# EAGLE design UTX_EE445M_Motor_Board (EAGLE 9.2.2)
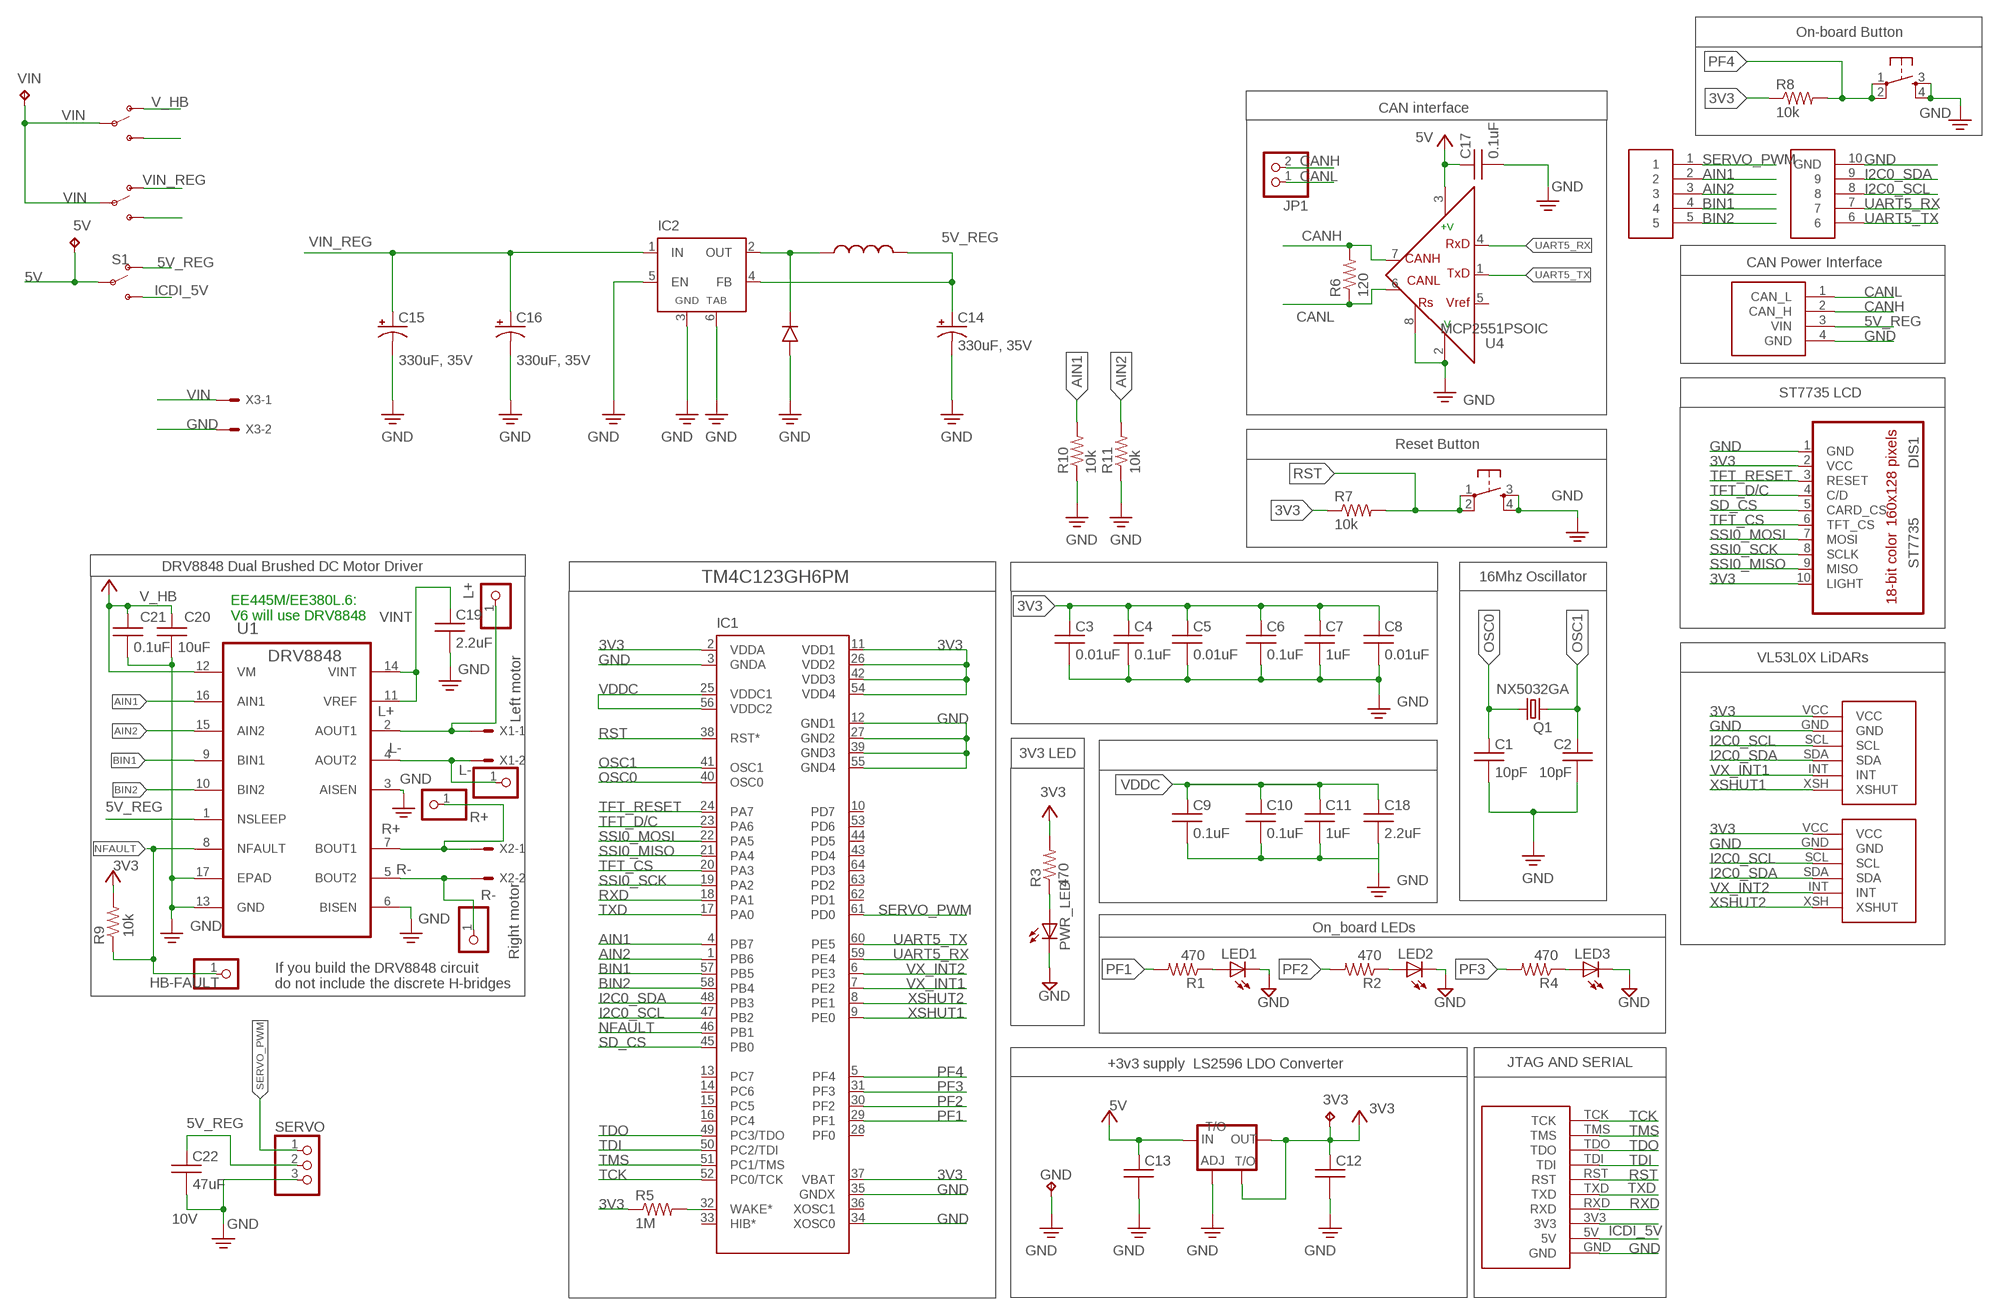
[diagram p0: schematic, sheet 1]

## Parts
3V3  TPPAD1-13  [P1-13]
5V  TPPAD1-13  [P1-13]
BUTTON  _SWITCH_DTSM-6  [_SWITCH_DTSM-6]
C1  10pF  CAPACITORC0603K  [C0603K]
C2  10pF  CAPACITORC0603K  [C0603K]
C3  0.01uF  CAPACITORC0603K  [C0603K]
C4  0.1uF  CAPACITORC0603K  [C0603K]
C5  0.01uF  CAPACITORC0603K  [C0603K]
C6  0.1uF  CAPACITORC0603K  [C0603K]
C7  1uF  CAPACITORC0603K  [C0603K]
C8  0.01uF  CAPACITORC0603K  [C0603K]
C9  0.1uF  CAPACITORC0603K  [C0603K]
C10  0.1uF  CAPACITORC0603K  [C0603K]
C11  1uF  CAPACITORC0603K  [C0603K]
C12  CAPACITORC0805K  [C0805K]
C13  CAPACITORC0603K  [C0603K]
C14  330uF, 35V  _CAPACITOR_POL_A_HA0  [_CAPACITOR_CHEMI-CON_A_HA0_SMD]
C15  330uF, 35V  _CAPACITOR_POL_A_HA0  [_CAPACITOR_CHEMI-CON_A_HA0_SMD]
C16  330uF, 35V  _CAPACITOR_POL_A_HA0  [_CAPACITOR_CHEMI-CON_A_HA0_SMD]
C17  0.1uF  CAPACITORC0603K  [C0603K]
C18  2.2uF  CAPACITORC0603K  [C0603K]
C19  2.2uF  CAPACITORC0603K  [C0603K]
C20  10uF  CAPACITORC0805K  [C0805K]
C21  0.1uF  CAPACITORC0603K  [C0603K]
C22  47uF  CAPACITORC0805K  [C0805K]
DIS1  ST7735  [ST7735]
GND  TPPAD1-13  [P1-13]
HB-FAULT  PINHD-1X1  [1X01]
IC1  TM4C123GH6PM  [SQFP-S-10X10-64]
IC2  _VOLTAG_REGULATOR_LM2596S  [_PACKAGE_TO263-5]
JP1  PINHD-1X2  [1X02]
L+  PINHD-1X1  [1X01]
L-  PINHD-1X1  [1X01]
LED1  LEDCHIP-LED0603  [CHIP-LED0603]
LED2  LEDCHIP-LED0603  [CHIP-LED0603]
LED3  LEDCHIP-LED0603  [CHIP-LED0603]
PWR_LED  LEDCHIP-LED0603  [CHIP-LED0603]
Q1  NX5032GA  [NX5032GA]
R1  470  RESISTORR0603  [R0603]
R2  470  RESISTORR0603  [R0603]
R3  470  R-US_R0603  [R0603]
R4  470  RESISTORR0603  [R0603]
R5  1M  RESISTORR0603  [R0603]
R6  120  RESISTORR0603  [R0603]
R7  10k  RESISTORR0603  [R0603]
R8  10k  RESISTORR0603  [R0603]
R9  10k  RESISTORR0603  [R0603]
R10  10k  RESISTORR0603  [R0603]
R11  10k  RESISTORR0603  [R0603]
R+  PINHD-1X1  [1X01]
R-  PINHD-1X1  [1X01]
RESET  _SWITCH_DTSM-6  [_SWITCH_DTSM-6]
S1  SWITCH-SPDT-PTH-11.6X4.0MM  [SWITCH_SPDT_PTH_11.6X4.0MM]
SERVO  PINHD-1X3  [1X03]
U1  DRV8848  [SOP65P640X120-17N]
U4  MCP2551PSOIC  [SO08]
U$1  JTAG_SERIAL  [JTAG_SERIAL_PTH]
U$2  LIDAR_VL53L0X_ATK_VERT  [LIDAR_VL53L0X_ATK_VERT]
U$3  LIDAR_VL53L0X_ATK_VERT  [LIDAR_VL53L0X_ATK_VERT]
U$4  _SWITCH_SPDT_4.7  [_SWITCH_SPDT_4.7]
U$5  _SWITCH_SPDT_4.7  [_SWITCH_SPDT_4.7]
U$9  _VOLTAGE_REGULATOR_AMS1117  [_PACKAGE_SOT223]
U$10  UTX_EE445M_BOARD_CONNECTOR  [_HEADER_2_4X1_ANGLED]
U$11  LOGIC_ANALYZER_10PIN  [LOGIC_ANALYZER_10PIN]
U$23  _INDUCTOR_PE-54040SNL  [_PACKAGE_HCI-68]
U$24  _DIODE_SOD128  [_PACKAGE_SOD128]
VIN  TPPAD1-13  [P1-13]
X1  KK-156-2  [KK-156-2]
X2  KK-156-2  [KK-156-2]
X3  KK-156-2  [KK-156-2]

## Nets
3V3: 3V3.TP C3.1 C4.1 C5.1 C6.1 C7.1 C8.1 C12.1 DIS1.2(VCC) DIS1.10(LIGHT) IC1.2(VDDA) IC1.11(VDD1) IC1.26(VDD2) IC1.37(VBAT) IC1.42(VDD3) IC1.54(VDD4) R3.2 R5.1 R7.1 R8.1 R9.2 U$2.VCC U$3.VCC U$9.2(OUT) U$9.4(T/O) ; supply symbol labelled +5V, +3V3
5V: 5V.TP C13.1 C17.1 S1.2(P) U4.3(VDD) U$9.3(IN) ; supply symbol labelled +5V
5V_REG: C14.+ C22.1 IC2.4(FB) S1.1(O) SERVO.2 U1.1(NSLEEP) U$10.3(VIN) U$23.2
AIN1: IC1.4(PB7) R10.2 U1.16(AIN1) U$11.2
AIN2: IC1.1(PB6) R11.2 U1.15(AIN2) U$11.3
BIN1: IC1.57(PB5) U1.9(BIN1) U$11.4
BIN2: IC1.58(PB4) U1.10(BIN2) U$11.5
CANH: JP1.2 R6.2 U4.7(CANH) U$10.2(CAN_H)
CANL: JP1.1 R6.1 U4.6(CANL) U$10.1(CAN_L)
GND: BUTTON.3 BUTTON.4 C1.2 C2.2 C3.2 C4.2 C5.2 C6.2 C7.2 C8.2 C9.2 C10.2 C11.2 C12.2 C13.2 C14.- C15.- C16.- C17.2 C18.2 C19.2 C20.2 C21.2 C22.2 DIS1.1(GND) GND.TP IC1.3(GNDA) IC1.12(GND1) IC1.27(GND2) IC1.34(XOSC0) IC1.35(GNDX) IC1.39(GND3) IC1.55(GND4) IC2.3(GND) IC2.5(EN) IC2.6(TAB) LED1.C LED2.C LED3.C PWR_LED.C R10.1 R11.1 RESET.3 RESET.4 SERVO.3 U1.3(AISEN) U1.6(BISEN) U1.13(GND) U1.17(EPAD) U4.2(VSS) U4.8(RS) U$1.GND U$2.GND U$3.GND U$9.1(ADJ) U$10.4(GND) U$11.10(GND) U$24.A(+) X3.2
I2C0_SCL: IC1.47(PB2) U$2.SCL U$3.SCL U$11.8
I2C0_SDA: IC1.48(PB3) U$2.SDA U$3.SDA U$11.9
ICDI_5V: S1.3(S) U$1.5V
L+: L+.1 U1.2(AOUT1) X1.1
L-: L-.1 U1.4(AOUT2) X1.2
N$1: U$1.3V3
N$4: LED1.A R1.1
N$6: PWR_LED.A R3.1
N$7: LED2.A R2.1
N$8: LED3.A R4.1
N$9: U$4.P$3(S)
N$11: IC2.2(OUT) U$23.1 U$24.C(-)
N$12: U$5.P$3(S)
N$19: IC1.32(WAKE*) R5.2
NFAULT: HB-FAULT.1 IC1.46(PB1) R9.1 U1.8(NFAULT)
OSC0: C1.1 IC1.40(OSC0) Q1.1
OSC1: C2.1 IC1.41(OSC1) Q1.2
PF1: IC1.29(PF1) R1.2
PF2: IC1.30(PF2) R2.2
PF3: IC1.31(PF3) R4.2
PF4: BUTTON.1 BUTTON.2 IC1.5(PF4) R8.2
R+: R+.1 U1.7(BOUT1) X2.1
R-: R-.1 U1.5(BOUT2) X2.2
RST: IC1.38(RST*) R7.2 RESET.1 RESET.2 U$1.RST
RXD: IC1.18(PA1) U$1.RXD
SD_CS: DIS1.5(CARD_CS) IC1.45(PB0)
SERVO_PWM: IC1.61(PD0) SERVO.1 U$11.1
SSI0_MISO: DIS1.9(MISO) IC1.21(PA4)
SSI0_MOSI: DIS1.7(MOSI) IC1.22(PA5)
SSI0_SCK: DIS1.8(SCLK) IC1.19(PA2)
TCK: IC1.52(PC0/TCK) U$1.TCK
TDI: IC1.50(PC2/TDI) U$1.TDI
TDO: IC1.49(PC3/TDO) U$1.TDO
TFT_CS: DIS1.6(TFT_CS) IC1.20(PA3)
TFT_D/C: DIS1.4(C/D) IC1.23(PA6)
TFT_RESET: DIS1.3(RESET) IC1.24(PA7)
TMS: IC1.51(PC1/TMS) U$1.TMS
TXD: IC1.17(PA0) U$1.TXD
UART5_RX: IC1.59(PE4) U4.4(RXD) U$11.7
UART5_TX: IC1.60(PE5) U4.1(TXD) U$11.6
V_HB: C20.1 C21.1 U1.12(VM) U$4.P$1(O) ; supply symbol labelled +11V1
VDDC: C9.1 C10.1 C11.1 C18.1 IC1.25(VDDC1) IC1.56(VDDC2)
VIN: U$4.P$2(P) U$5.P$2(P) VIN.TP X3.1
VIN_REG: C15.+ C16.+ IC2.1(IN) U$5.P$1(O)
VINT: C19.1 U1.11(VREF) U1.14(VINT)
VX_INT1: IC1.7(PE2) U$2.INT
VX_INT2: IC1.6(PE3) U$3.INT
XSHUT1: IC1.9(PE0) U$2.XSH(XSHUT)
XSHUT2: IC1.8(PE1) U$3.XSH(XSHUT)
Unconnected: IC1.10(PD7) IC1.13(PC7) IC1.14(PC6) IC1.15(PC5) IC1.16(PC4) IC1.28(PF0) IC1.33(HIB*) IC1.36(XOSC1) IC1.43(PD4) IC1.44(PD5) IC1.53(PD6) IC1.62(PD1) IC1.63(PD2) IC1.64(PD3) U4.5(VREF)

## Notes on the sheet
- On-board Button
- CAN interface
- CAN Power Interface
- ST7735 LCD
- Reset Button
- DRV8848 Dual Brushed DC Motor Driver
- 16Mhz Oscillator
- EE445M/EE380L.6: 
  V6 will use DRV8848
- VL53L0X LiDARs
- Left motor
- 3V3 LED
- On_board LEDs
- Right motor
- If you build the DRV8848 circuit
  do not include the discrete H-bridges
- +3v3 supply  LS2596 LDO Converter | JTAG AND SERIAL
- 10V

## Library data of the parts
3V3 5V GND VIN = testpad:TP: Test pad
BUTTON RESET = Z:_SWITCH_DTSM-6
C1 C3-C13 C17-C19 C21 C22 = UT_ECE:CAPACITOR: CAPACITOR, American symbol
C2 = UT_ECE:CAPACITOR: CAPACITOR, American symbol; SPICEPREFIX: C
C14-C16 = Z:_CAPACITOR_POL
C20 = EE445L:CAPACITOR: CAPACITOR, American symbol
DIS1 = UT_ECE:ST7735: Sitronix ST7735R 18-bit color, 1.8" TFT LCD display, 128*160, http://www.adafruit.com/products/358 // Backlight (pin 10) connected to +3.3 V // MISO (pin 9) PA4 (SSI0Rx) // SCK (pin 8) connected to PA2 (SSI0Clk) // MOSI (pin 7) connected to PA5 (SSI0Tx) // TFT_CS (pin 6) connected to PA3 (SSI0Fss) // CARD_CS (pin 5) connected to PD7 GPIO output(for SDC) // Data/Command (pin 4) connected to PA6 (GPIO), high for data, low for command // RESET (pin 3) connected to PA7 (GPIO) // VCC (pin 2) connected to +3.3 V // Gnd (pin 1) connected to ground; OC_FARNELL: unknown; OC_NEWARK: unknown
HB-FAULT L+ L- R+ R- = EE445L:PINHD-1X1: PIN HEADER
IC1 = UT_ECE:TM4C123: Tiva™ TM4C123GH6PM Microcontroller Texas Instrument's Tiva™ C Series microcontrollers provide designers a high-performance ARM® Cortex™-M-based architecture with a broad set of integration capabilities and a strong ecosystem of software and development tools. Targeting performance and flexibility, the Tiva™ C Series architecture offers a 80 MHz Cortex-M with FPU, a variety of integrated memories and multiple programmable GPIO. Tiva™ C Series devices offer consumers compelling cost-effective solutions by integrating application-specific peripherals and providing a comprehensive library of software tools which minimize board costs and design-cycle time. Offering quicker time-to-market and cost savings, the Tiva™ C Series microcontrollers are the leading choice in high-performance 32-bit applications.
IC2 = Z:_VOLTAG_REGULATOR: STEP-DOWN VOLTAGE REGULATOR
JP1 = UT_ECE:PINHD-1X2: PIN HEADER
LED1-LED3 PWR_LED = led:LED: LED OSRAM: - CHIPLED LG R971, LG N971, LY N971, LG Q971, LY Q971, LO R971, LY R971 LH N974, LH R974 LS Q976, LO Q976, LY Q976 LO Q996 - Hyper CHIPLED LW Q18S LB Q993, LB Q99A, LB R99A - SideLED LS A670, LO A670, LY A670, LG A670, LP A670 LB A673, LV A673, LT A673, LW A673 LH A674 LY A675 LS A676, LA A676, LO A676, LY A676, LW A676 LS A679, LY A679, LG A679 - Hyper Micro SIDELED® LS Y876, LA Y876, LO Y876, LY Y876 LT Y87S - SmartLED LW L88C, LW L88S LB L89C, LB L89S, LG L890 LS L89K, LO L89K, LY L89K LS L896, LA L896, LO L896, LY L896 - TOPLED LS T670, LO T670, LY T670, LG T670, LP T670 LSG T670, LSP T670, LSY T670, LOP T670, LYG T670 LG T671, LOG T671, LSG T671 LB T673, LV T673, LT T673, LW T673 LH T674 LS T676, LA T676, LO T676, LY T676, LB T676, LH T676, LSB T676, LW T676 LB T67C, LV T67C, LT T67C, LS T67K, LO T67K, LY T67K, LW E67C LS E67B, LA E67B, LO E67B, LY E67B, LB E67C, LV E67C, LT E67C LW T67C LS T679, LY T679, LG T679 LS T770, LO T770, LY T770, LG T770, LP T770 LB T773, LV T773, LT T773, LW T773 LH T774 LS E675, LA E675, LY E675, LS T675 LS T776, LA T776, LO T776, LY T776, LB T776 LHGB T686 LT T68C, LB T68C - Hyper Mini TOPLED® LB M676 - Mini TOPLED Santana® LG M470 LS M47K, LO M47K, LY M47K Source: http://www.osram.convergy.de LUXEON: - LUMILED® LXK2-PW12-R00, LXK2-PW12-S00, LXK2-PW14-U00, LXK2-PW14-V00 LXK2-PM12-R00, LXK2-PM12-S00, LXK2-PM14-U00 LXK2-PE12-Q00, LXK2-PE12-R00, LXK2-PE12-S00, LXK2-PE14-T00, LXK2-PE14-U00 LXK2-PB12-K00, LXK2-PB12-L00, LXK2-PB12-M00, LXK2-PB14-N00, LXK2-PB14-P00, LXK2-PB14-Q00 LXK2-PR12-L00, LXK2-PR12-M00, LXK2-PR14-Q00, LXK2-PR14-R00 LXK2-PD12-Q00, LXK2-PD12-R00, LXK2-PD12-S00 LXK2-PH12-R00, LXK2-PH12-S00 LXK2-PL12-P00, LXK2-PL12-Q00, LXK2-PL12-R00 Source: www.luxeon.com KINGBRIGHT: KA-3528ASYC Source: www.kingbright.com
Q1 = UT_ECE:NX5032GA: 16 MHz Crystal 4mm SMD Digikey NX5032GA-16.000000; OC_FARNELL: unknown; OC_NEWARK: unknown
R1 R2 R4-R11 = UT_ECE:RESISTOR: RESISTOR, American symbol
R3 = rcl:R-US_: RESISTOR, American symbol; SPICEPREFIX: R
S1 = SparkFun-Switches:SWITCH-SPDT: Single Pole, Double Throw (SPDT) Switch Single-pole, double-throw (SPDT) switch. Variant Overview SMD-AYZ0202 Surface Mount DPDT Switch <https://www.sparkfun.com/products/597> (COM-00597) Used on e.g. LilyPad Arduino USB - ATmega32U4 Board <https://www.sparkfun.com/products/12049> PTH-11.6X4.0MM SPDT Mini Power Switch <https://www.sparkfun.com/products/102> (COM-00102) Used on e.g. SparkFun Simon Says - Through-Hole Soldering Kit <https://www.sparkfun.com/products/10547> (KIT-10547) PTH-11.6X4.0MM-KIT KIT version of SPDT Mini Power Switch - Simplifies soldering by removing tStop of switch pins - only one side can be soldered. PTH-11.6X4.0MM-LOCK LOCK version of SPDT Mini Power Switch - Offset pins hold switch in place for easier soldering. SMD-RIGHT-ANGLE Surface Mount Right Angle Switch <https://www.sparkfun.com/products/10860> (COM-10860) Used on e.g. SparkFun ESP8266 Thing <https://www.sparkfun.com/products/13231>; PROD_ID: SWCH-08261; SF_SKU: COM-00102
SERVO = EE445L:PINHD-1X3: PIN HEADER
U1 = UT_ECE:DRV8848: DMOS FULL-BRIDGE MOTOR DRIVERS; MPN: DRV8848; PACKAGE: TSSOP-16; SUPPLIER: Texas Instruments
U4 = UT_ECE:MCP2551P: MCP2551p CAN interface driver
U$1 = Z:JTAG_SERIAL
U$2 U$3 = Z:LIDAR_VL53L0X_ATK_VERT
U$4 U$5 = Z:_SWITCH_SPDT_4.7
U$9 = Z:_VOLTAGE_REGULATOR_AMS1117
U$10 = Z:UTX_EE445M_BOARD_CONNECTOR: Seeedstudio grove 2mm spacing, Valvano http://www.seeedstudio.com/depot/Grove-Universal-4-pin-connector-9010-PCs-p-790.html?cPath=44_80
U$11 = Z:LOGIC_ANALYZER_10PIN
U$23 = Z:_INDUCTOR
U$24 = Z:_DIODE
X1 X2 = EE445L:KK-156-2: KK 156 HEADER Source: http://www.molex.com/pdm_docs/sd/026604100_sd.pdf; OC_FARNELL: unknown; OC_NEWARK: unknown
X3 = UT_ECE:KK-156-2: KK 156 HEADER Source: http://www.molex.com/pdm_docs/sd/026604100_sd.pdf; OC_FARNELL: unknown; OC_NEWARK: unknown

## Board
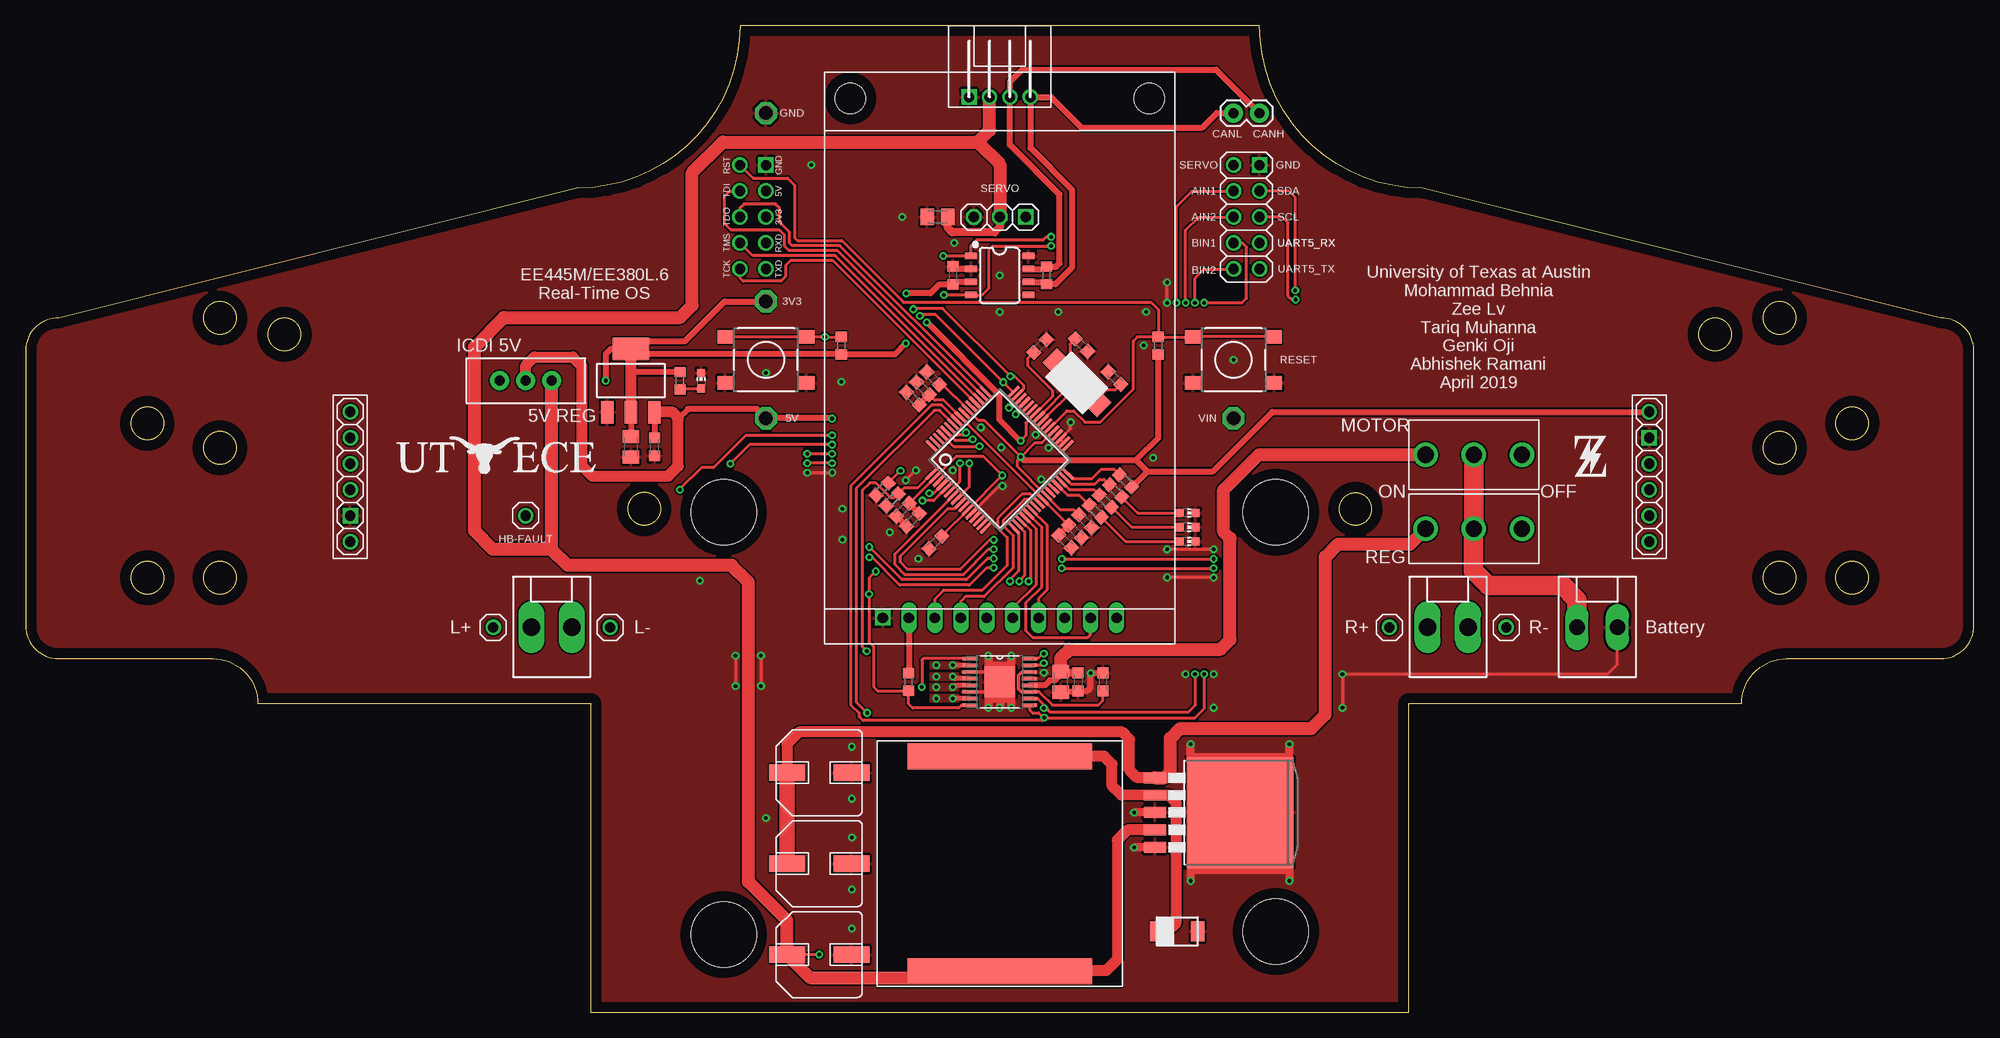
[diagram p1: board, top side]
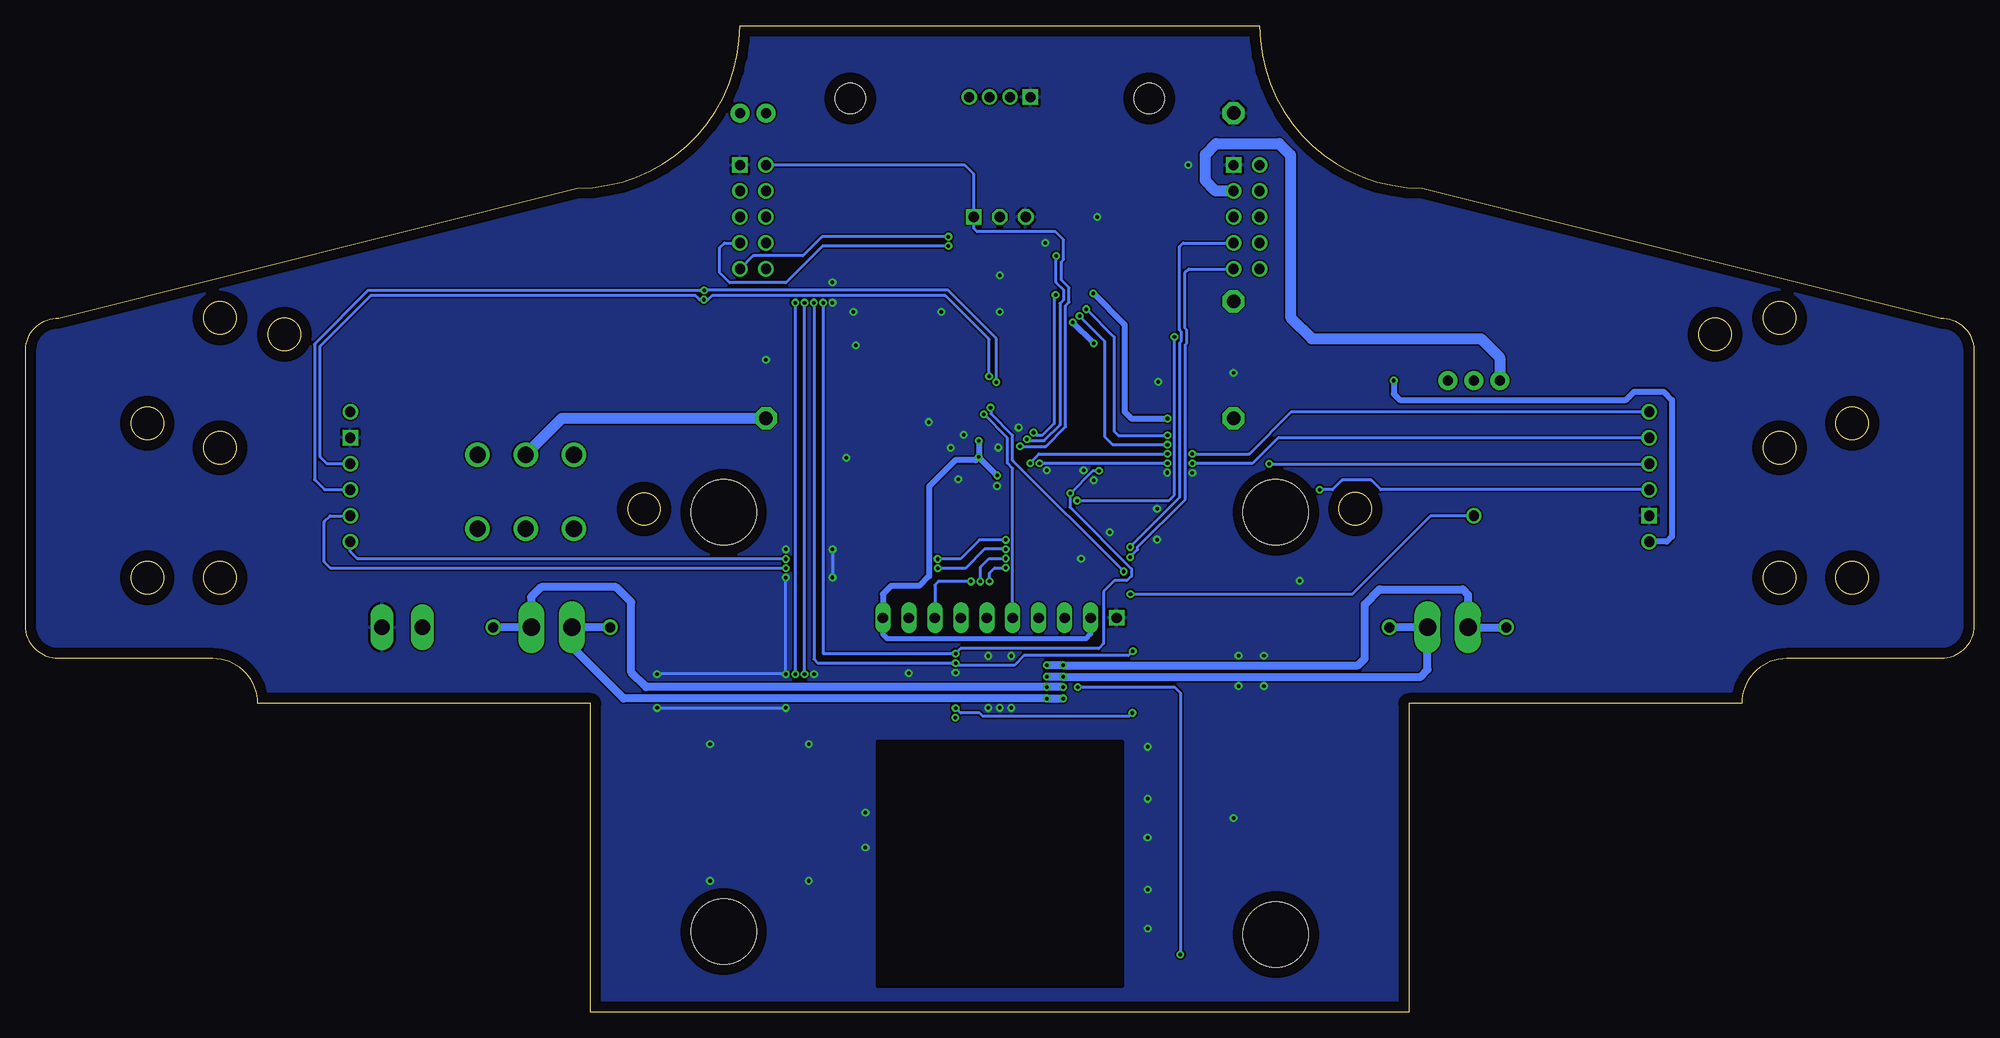
[diagram p2: board, bottom side, seen from below]

Size 190.5 x 96.5 mm. Coordinates in mm from the lower left corner, seen from the top.
Outline: 55.25,0 135.25,0 135.25,30.2 167.8,30.2 arc-90 172.2,34.6 187.3,34.6 arc90 190.5,37.8 190.5,64.8 arc90 187.25,67.9 136.55,80.6 arc-90 120.65,96.5 69.85,96.5 arc-90 53.95,80.6 3.25,67.9 arc90 0,64.8 0,37.8 arc90 3.2,34.6 18.3,34.6 arc-90 22.7,30.2 55.25,30.2 55.25,0
Outline: circle at 19,67.9 radius 1.6
Outline: circle at 19,55.2 radius 1.6
Outline: circle at 11.9,57.6 radius 1.6
Outline: circle at 11.9,42.5 radius 1.6
Outline: circle at 19,42.5 radius 1.6
Outline: circle at 25.3,66.3 radius 1.6
Outline: circle at 171.5,67.9 radius 1.6
Outline: circle at 171.5,55.2 radius 1.6
Outline: circle at 178.6,57.6 radius 1.6
Outline: circle at 178.6,42.5 radius 1.6
Outline: circle at 171.5,42.5 radius 1.6
Outline: circle at 165.2,66.3 radius 1.6
Outline: circle at 130.01,49.23 radius 1.59
Outline: circle at 60.49,49.23 radius 1.6
Copper layers (1*16): Top 0.035mm / dielectric 1.5mm / Bottom 0.035mm
Design rules "default": minimum track width 6mil, minimum drill 0.35mm, track to track 6mil, track to pad 6mil, pad to pad 6mil, via to via 6mil, smd to smd 6mil, copper to edge 40mil, drill to drill 6mil, minimum pad ring 10mil, minimum via ring 8mil, stop-mask expansion 4mil, vias tented up to drill 0mil, thermal gap 10mil
Holes 6.4 mm at 122.25,48.9 68.25,48.9 68.25,7.6 122.25,7.9

### Footprints (pad centres in the part's own frame; a part is rotated, then mirrored left to right if it is on the bottom)
P1-13 = drill 1.321 pad 2.159 octagon: TP 0,0
_SWITCH_DTSM-6 = smd 1.55 x 1.3: 1 -3.975,2.25; 2 3.975,2.25; 3 -3.975,-2.25; 4 3.975,-2.25
C0603K = smd 1.05 x 1.08: 1 -0.875,0; 2 0.875,0
C0805K = smd 1.3 x 1.6: 1 -1,0; 2 1,0
_CAPACITOR_CHEMI-CON_A_HA0_SMD = smd 3.5 x 1.6: + -3.15,0; - 3.15,0
ST7735 = drill 1 square: 1 -11.43,-26.67 | drill 1 long: 2 -8.89,-26.67; 3 -6.35,-26.67; 4 -3.81,-26.67; 5 -1.27,-26.67; 6 1.27,-26.67; 7 3.81,-26.67; 8 6.35,-26.67; 9 8.89,-26.67; 10 11.43,-26.67 | hole 3: -14.605,24.13; 14.605,24.13
1X01 = drill 1: 1 0,0
SQFP-S-10X10-64 = smd 0.3 x 1.6: 1 -3.75,-5.6; 2 -3.25,-5.6; 3 -2.75,-5.6; 4 -2.25,-5.6; 5 -1.75,-5.6; 6 -1.25,-5.6; 7 -0.75,-5.6; 8 -0.25,-5.6; 9 0.25,-5.6; 10 0.75,-5.6; 11 1.25,-5.6; 12 1.75,-5.6; 13 2.25,-5.6; 14 2.75,-5.6; 15 3.25,-5.6; 16 3.75,-5.6; 33 3.75,5.6; 34 3.25,5.6; 35 2.75,5.6; 36 2.25,5.6; 37 1.75,5.6; 38 1.25,5.6; 39 0.75,5.6; 40 0.25,5.6; 41 -0.25,5.6; 42 -0.75,5.6; 43 -1.25,5.6; 44 -1.75,5.6; 45 -2.25,5.6; 46 -2.75,5.6; 47 -3.25,5.6; 48 -3.75,5.6 | smd 1.6 x 0.3: 17 5.6,-3.75; 18 5.6,-3.25; 19 5.6,-2.75; 20 5.6,-2.25; 21 5.6,-1.75; 22 5.6,-1.25; 23 5.6,-0.75; 24 5.6,-0.25; 25 5.6,0.25; 26 5.6,0.75; 27 5.6,1.25; 28 5.6,1.75; 29 5.6,2.25; 30 5.6,2.75; 31 5.6,3.25; 32 5.6,3.75; 49 -5.6,3.75; 50 -5.6,3.25; 51 -5.6,2.75; 52 -5.6,2.25; 53 -5.6,1.75; 54 -5.6,1.25; 55 -5.6,0.75; 56 -5.6,0.25; 57 -5.6,-0.25; 58 -5.6,-0.75; 59 -5.6,-1.25; 60 -5.6,-1.75; 61 -5.6,-2.25; 62 -5.6,-2.75; 63 -5.6,-3.25; 64 -5.6,-3.75
_PACKAGE_TO263-5 = smd 1.067 x 2.159: 1 -3.404,-5.791; 2 -1.702,-5.791; 3 0,-5.791; 4 1.702,-5.791; 5 3.404,-5.791 | smd 10.8 x 10.41: 6 0,2.54
1X02 = drill 1 pad 1.88: 1 0,0; 2 2.54,0
CHIP-LED0603 = smd 0.8 x 0.8: A 0,-0.75; C 0,0.75
NX5032GA = smd 2.54 x 2: 1 -2.5,0; 2 2.5,0
R0603 = smd 1 x 1.1: 1 -0.85,0; 2 0.85,0
SWITCH_SPDT_PTH_11.6X4.0MM = drill 1.016 pad 1.88: 1 0,2.54; 2 0,0; 3 0,-2.54
1X03 = drill 1 square: 1 -2.54,0 | drill 1 octagon: 2 0,0; 3 2.54,0
SOP65P640X120-17N = smd 1.473 x 0.356: 1 -2.921,2.286; 2 -2.921,1.626; 3 -2.921,0.965; 4 -2.921,0.33; 5 -2.921,-0.33; 6 -2.921,-0.965; 7 -2.921,-1.626; 8 -2.921,-2.286; 9 2.921,-2.286; 10 2.921,-1.626; 11 2.921,-0.965; 12 2.921,-0.33; 13 2.921,0.33; 14 2.921,0.965; 15 2.921,1.626; 16 2.921,2.286 | smd 2.997 x 2.997: 17 0,0
SO08 = smd 0.6 x 1.2: 1 -1.905,-2.8; 2 -0.635,-2.8; 3 0.635,-2.8; 4 1.905,-2.8; 5 1.905,2.8; 6 0.635,2.8; 7 -0.635,2.8; 8 -1.905,2.8
JTAG_SERIAL_PTH = drill 1: 3V3 0,-1.27; 5V 2.54,-1.27; RST 5.08,1.27; RXD -2.54,-1.27; TCK -5.08,1.27; TDI 2.54,1.27; TDO 0,1.27; TMS -2.54,1.27; TXD -5.08,-1.27 | drill 1 square: GND 5.08,-1.27
LIDAR_VL53L0X_ATK_VERT = drill 1 square: GND -3.81,0 | drill 1: INT 3.81,0; SCL -1.27,0; SDA 1.27,0; VCC -6.35,0; XSH 6.35,0
_SWITCH_SPDT_4.7 = drill 1.6: P$1 -4.7,0; P$2 0,0; P$3 4.7,0
_PACKAGE_SOT223 = smd 1.219 x 2.235: 1 -2.311,-3.099; 2 0,-3.099; 3 2.311,-3.099 | smd 3.6 x 2.2: 4 0,3.099
_HEADER_2_4X1_ANGLED = drill 1 pad 1.3: 1 -3,0; 2 -1,0; 3 1,0 | drill 1 pad 1.3 square: 4 3,0
LOGIC_ANALYZER_10PIN = drill 1: 1 -1.27,5.08; 2 -1.27,2.54; 3 -1.27,0; 4 -1.27,-2.54; 5 -1.27,-5.08; 6 1.27,-5.08; 7 1.27,-2.54; 8 1.27,0; 9 1.27,2.54 | drill 1 square: 10 1.27,5.08
_PACKAGE_HCI-68 = smd 18 x 2.54: 1 0,-10.5; 2 0,10.5
_PACKAGE_SOD128 = smd 1.3 x 1.95: A -2,0; C 2,0
KK-156-2 = drill 1.7 pad 2.184 long: 1 -1.98,0; 2 1.98,0
KK-156-2' = drill 1.5 pad 2.184 long: 1 -1.98,0; 2 1.98,0

### Placement (x,y rotation side)
3V3  72.39,69.53 0 top
5V  72.39,58.09 0 top
BUTTON  72.39,63.81 0 top
C1  106.48,62.02 135 top
C2  103.24,65.26 315 top
C3  103.61,48.02 315 top
C4  88.73,62 135 top
C5  86.75,48.16 225 top
C6  88.95,45.96 225 top
C7  99.2,65.17 45 top
C8  85.77,49.15 225 top
C9  102.62,47.03 315 top
C10  87.74,61.01 135 top
C11  101.63,46.04 315 top
C12  59.18,55.3 270 top
C13  61.48,55.3 270 top
C14  77.6,5.64 0 top
C15  77.6,23.42 0 top
C16  77.6,14.53 0 top
C17  90.68,72.06 90 top
C18  86.75,60.03 135 top
C19  105.33,32.31 90 top
C20  101.22,32.31 270 top
C21  102.92,32.31 270 top
C22  89.15,77.78 180 top
DIS1  95.25,65.25 0 top
GND  72.39,87.94 0 top
HB-FAULT  48.9,48.57 0 top
IC1  95.25,54.03 315 top
IC2  116.21,19.54 270 top
JP1  118.11,87.94 0 top
L+  45.72,37.65 0 top
L-  57.15,37.65 0 top
LED1  113.63,46.04 270 top
LED2  113.63,47.44 270 top
LED3  113.63,48.84 270 top
PWR_LED  66.04,61.77 0 top
Q1  102.79,61.57 135 top
R1  104.6,49.01 135 top
R2  105.58,50 135 top
R3  63.98,61.77 90 top
R4  106.57,50.98 135 top
R5  107.56,51.97 135 top
R6  99.82,72.06 90 top
R7  110.74,65.21 90 top
R8  79.76,65.21 90 top
R9  86.33,32.31 90 top
R10  83.74,51.16 45 top
R11  84.76,50.14 45 top
R+  133.35,37.65 0 top
R-  144.78,37.65 0 top
RESET  118.11,63.81 0 top
S1  48.9,61.78 270 top
SERVO  95.25,77.78 180 top
U1  95.25,32.31 0 top
U4  95.25,72.06 270 top
U$1  71.12,77.78 90 top
U$2  158.75,52.38 270 top
U$3  31.75,52.38 90 top
U$4  141.6,54.54 0 top
U$5  141.6,47.3 0 top
U$6  [__LOGO_UT_ECE]  35.81,52.38 0 top
U$7  [__LOGO_Z]  151.46,52.38 0 top
U$9  59.18,61.78 0 top
U$10  95.25,89.5 180 top
U$11  119.38,77.78 0 top
U$23  95.25,14.53 180 top
U$24  112.6,7.9 180 top
VIN  118.11,58.09 0 top
X1  51.44,37.65 0 top
X2  139.06,37.65 0 top
X3  [KK-156-2']  153.67,37.65 0 top

### Tracks (layer width: path | path; a pad name or v marks a point on that pad's centre or on a via)
3V3  (via drill 0.35)
  Top 0.305: C7.1 97.94,63.91 97.94,63.26 100.41,60.8 100.41,60.23 98.7,58.52 IC1.42 | IC1.42 | C3.1 102.49,49.14 101.2,49.14 IC1.26 96.94,53.41 96.94,53.94 v97.31,54.31 | C6.1 IC1.11 v95.49,52.51 v95.5,52.51 93.62,54.39 91.01,54.39 IC1.2 C8.1 | v97.31,54.31 93.7,57.92 93.13,57.92 IC1.54 89.67,61.38 C4.1 | v97.31,54.31 98.7,55.71 99.4,55.71 IC1.37 | IC1.42 97.81,57.65 97.81,56.41 v97.3,55.88
  Top 0.61: C8.1 C5.1 | v97.31,54.31 97.61,54.01 108.59,54.01 | v88.12,67.48 95.19,60.41 95.19,59.61 95.18,59.6 95.18,58 v97.3,55.88 | U$9.2 C12.1 | v86.06,65.42 84.99,64.36 R8.1 59.7,64.36 U$9.4 | 108.59,54.01 109.69,52.9 | 109.69,52.9 116.07,52.9 121.89,58.72 158.74,58.72 U$2.VCC | R5.1 109.69,52.9 | U$9.4 57.2,64.88 56.72,64.39 v56.72,61.78 | U$9.4 59.94,65.64 64.48,65.64 68.36,69.53 3V3.TP | 108.59,54.01 110.74,56.16 R7.1 | R3.2 59.18,62.62 | DIS1.2 86.36,33.19 R9.2
  Top 1.067: U$9.2 59.18,62.62 U$9.4
  Bottom 0.508: DIS1.2 86.36,37 86.84,36.52 106.24,36.52 106.68,36.96 DIS1.10
  Bottom 0.61: v95.5,52.51 v97.31,54.31 | v97.3,55.88 97.3,54.32 v97.31,54.31 | v97.31,54.31 97.61,54.01 99.58,54.01 102.16,51.43 102.16,42.65 103.1,41.71 105.88,41.71 106.68,40.91 DIS1.10 | v86.06,65.42 v88.11,67.48 v88.12,67.48 | v56.72,61.78 56.72,60.48 56.13,59.9 34.01,59.9 33.21,60.7 30.33,60.7 29.53,59.9 29.53,46.52 30.03,46.02 30.05,46.03 U$3.VCC
5V  (via drill 0.35)
  Top 0.61: U4.3 90.92,71.43 C17.1 89.33,71.19 88.47,70.33 86.12,70.33 v86.11,70.31 | U$9.3 61.49,56.17 C13.1 | 63.82,58.06 64.77,59.01 71.48,59.01 5V.TP 78.83,58.09 v78.85,58.07
  Top 1.067: S1.2 48.9,63.25 49.73,64.09 53.49,64.09 54.37,63.21 54.37,53.47 55.41,52.43 62.84,52.43 63.82,53.41 63.82,58.06 63.82,58.16 63.3,58.68 U$9.3
  Bottom 0.61: v86.11,70.31 83.03,67.24 83.03,58.73 82.37,58.07 v78.85,58.07
5V_REG  (via drill 0.35)
  Top 0.305: U1.1 92.3,34.62 87.82,34.62 87.63,34.44 v87.63,31.81 | v77.6,5.64 C14.+
  Top 0.762: SERVO.2 95.25,76.8 94.74,76.29 90.6,76.29 90.15,76.74 C22.1
  Top 1.067: IC2.4 107.75,17.84 106.76,16.84 106.76,5.19 105.64,4.07 95.28,4.07 U$23.2
  Top 1.27: U$23.2 94.6,3.38 76.71,3.38 C14.+ 74.45,8.98 70.67,12.76 70.67,42.07 69.04,43.71 53.02,43.71 51.45,45.28 | 51.45,45.28 51.45,61.77 S1.1 | 51.45,45.28 45.68,45.28 43.89,47.07 43.89,65.08 46.76,67.95 64.01,67.95 65.18,69.12 65.18,82.1 68.17,85.09 93.08,85.09 | U$10.3 94.25,86.27 93.08,85.09 | 93.08,85.09 95.25,82.92 SERVO.2
  Bottom 0.305: v87.63,31.81 78.16,31.81 77.6,31.25 v77.6,5.64
AIN1  (via drill 0.35)
  Top 0.305: IC1.4 88.8,50.77 v88.36,50.77 v88.35,50.76 | U1.16 98.18,34.62 98.99,34.62 99.45,35.08 v99.57,35.08 | v112.52,69.4 112.52,78.81 114.03,80.32 U$11.2 | v85.55,52.96 R10.2 | R10.2
  Bottom 0.305: v112.52,69.4 112.52,35.08 v99.57,35.08 99.07,35.58 85.57,35.58 85.09,36.06 85.09,41.15 84.04,42.21 82.82,42.21 82.36,42.66 82.36,43.36 88.41,49.41 88.41,50.7 v88.35,50.76 86.14,52.96 v85.55,52.96
AIN2  (via drill 0.35)
  Top 0.305: IC1.1 87.2,51.29 85.9,51.29 R11.2 84.92,50.31 84.6,50.31 83.13,51.77 82.55,51.77 81.79,51.01 81.79,35.77 v82.23,35.32 | v99.57,34.14 99.35,33.94 U1.15 | v113.43,69.4 113.43,76.49 114.72,77.78 U$11.3
  Bottom 0.305: v82.23,35.32 82.68,34.88 92.89,34.88 93.83,33.94 99.35,33.94 v99.57,34.14 113.03,34.14 113.43,34.54 v113.43,69.4
BIN1  (via drill 0.35)
  Top 0.305: IC1.57 89.55,59.38 88.59,59.38 80.67,51.45 80.67,30.08 81.48,29.27 81.48,28.94 81.89,28.53 99.37,28.53 99.59,28.76 v99.59,28.81 | U1.9 98.17,29.57 98.45,29.29 99.06,29.29 99.54,28.8 v99.59,28.81 | v115.25,33.08 115.25,29.71 114.35,28.81 v99.59,28.81 | v115.25,69.4 118.95,69.4 119.38,69.83 119.38,74.85 118.99,75.24 U$11.4
  Bottom 0.305: v115.25,33.08 v115.25,69.39 v115.25,69.4
BIN2  (via drill 0.35)
  Top 0.305: IC1.58 89.36,58.86 88.85,58.86 81.2,51.21 81.2,30.35 v82.27,29.28 v82.28,29.28 | U1.10 98.92,30.69 99.57,30.04 v99.57,29.75 99.82,29.75 100.18,29.39 113.72,29.39 114.34,30.02 v114.34,33.08 | v114.34,69.4 114.34,71.8 115.24,72.7 U$11.5
  Bottom 0.305: v82.28,29.28 82.59,28.97 96.93,28.97 97.22,29.27 99.06,29.27 v99.57,29.75 | v114.34,69.4 v114.34,33.08
CANH
  Top 0.61: U4.7 99.61,72.7 R6.2 100.76,72.92 101.11,73.26 101.11,79.98 96.24,84.84 U$10.2 96.25,91.01 97.44,92.2 116.39,92.2 JP1.2
CANL
  Top 0.61: U4.6 99.61,71.43 R6.1 100.71,71.21 102.31,72.81 102.31,80.47 98.25,84.53 U$10.1 100.28,89.5 103.26,86.52 115.06,86.52 116.48,87.94 JP1.1
GND  (via drill 0.35)
  Top 0.305: IC1.12 95.16,51.47 v95.52,51.47 | IC1.35 IC1.34 | IC1.35 100.31,55.2 v100.05,55.2 | IC1.35 102.18,57.08 v102.18,57.71 | v78.87,52.79 78.84,52.76 v76.42,52.76 | v69.42,34.87 v69.42,31.91 | v71.91,34.87 v71.91,31.91 | v116.18,42.52 111.64,42.52 v111.61,42.52 | v116.18,45.27 v111.61,45.27 | v128.75,29.78 v128.75,33.08 154.69,33.08 155.65,34.04 X3.2 | v111.61,69.4 v111.61,71.38 | v86.06,52.02 87.05,53.02 v87.06,53.02
  Top 0.356: U1.3 94.28,33.28 U1.17 94.28,31.35 U1.6
  Top 0.61: U4.2 90.92,72.7 C17.2 | C8.2 C5.2 | C5.2 | C20.2 102.8,31.31 C21.2 103.85,31.44 104.14,31.73 v104.14,33.18 105.32,33.18 C19.2
  Top 0.762: IC2.3 v108.39,19.54 v108.38,19.54 | IC2.5 110.39,16.11 v108.38,16.11 | v96.37,34.85 96.37,33.91 | 96.37,33.91 96.37,32.31 | v94.13,34.85 94.13,33.91 | 94.13,33.91 94.13,32.31 | U1.17 95.25,30.71 | 95.25,30.71 v95.25,29.77 | U1.17 96.37,32.31 | 96.37,32.31 96.37,30.71 | 96.37,30.71 v96.37,29.77 | U1.17 94.13,32.31 | 94.13,32.31 94.13,30.71 | 94.13,30.71 v94.13,29.77 | 94.13,33.91 95.25,33.91 96.37,33.91 | 94.13,30.71 95.25,30.71 | 95.25,30.71 96.37,30.71 | IC2.6 113.92,24.37 113.92,24.99 | 113.92,24.99 v113.92,26.22 | IC2.6 123.57,24.37 123.57,25.01 | 123.57,25.01 v123.57,26.22 | IC2.6 113.92,14.71 113.92,13.94 | 113.92,13.94 v113.92,12.86 | IC2.6 123.57,14.71 123.57,13.87 | 123.57,13.87 v123.57,12.86 | 113.92,24.99 123.55,24.99 123.57,25.01 | 113.92,13.94 123.51,13.94 123.57,13.87
  Bottom 0.305: v116.18,42.52 v116.18,33.08 v128.75,33.08 | v111.61,45.27 v111.61,42.52 | v128.75,29.78 v116.18,29.78
  other vias: 99.57,33.2 90.65,53.02 93.41,57.19 98.77,56.48 95.4,55.24 99.3,52.13 84.51,46.96 87.3,44.37 79.87,49.26 95.25,72.06 95.25,68.51 100.97,68.51 109.32,65.23 118.11,63.81 80.77,25.96 80.77,20.88 80.8,17.07 80.77,11.99 80.77,8.18 72.39,18.98 113.41,33.08 79.76,61.65 72.39,62.54 85.72,77.78 90.81,75.24 65.91,42.22 76.84,82.86 110.26,54.23 109.55,68.51 79.87,46.23
  pour Top (rank 2): -0.08,96.6 -0.08,0.03 190.5,0.03 190.5,96.6
  cutout Top: 83.26,26.52 83.26,2.52 107.21,2.52 107.21,26.52
  pour Bottom: -0.08,96.6 -0.08,0.03 190.5,0.03 190.5,96.6
  cutout Bottom: 83.26,26.52 83.26,2.52 107.21,2.52 107.21,26.52
I2C0_SCL  (via drill 0.35)
  Top 0.305: IC1.47 97.6,60.98 97.6,61.3 96.7,62.2 v96.29,62.2 89.66,68.83 86.85,68.83 v86.78,68.77 | v124.18,69.7 123.79,69.7 123.44,70.05 123.44,77.22 122.89,77.78 U$11.8 | v78.85,56.43 70.41,56.43 67.25,53.27 66.08,53.27 63.97,51.16 v63.97,51.11
  Bottom 0.305: v96.29,62.2 96.29,65.82 100.56,70.08 123.39,70.08 123.78,69.7 v124.18,69.7 124.61,69.7 124.99,70.08 156.74,70.08 161.72,65.11 161.72,54.34 161.04,53.65 U$2.SCL | v86.78,68.77 84.06,66.04 84.06,56.83 83.66,56.43 v78.85,56.43 | v63.97,51.11 v63.96,51.11 62.71,51.11 61.79,52.03 58.93,52.03 58,51.11 U$3.SCL
I2C0_SDA  (via drill 0.35)
  Top 0.305: IC1.48 v95.58,61.62 v95.58,61.63 88.98,68.23 87.58,68.23 v87.45,68.1 | v124.16,70.61 124.16,79.67 123.51,80.32 U$11.9 | v78.85,55.52 70.78,55.52 v68.9,53.64
  Bottom 0.305: v95.58,61.63 95.58,65.89 100.31,70.62 124.14,70.62 v124.16,70.61 124.17,70.62 156.99,70.62 162.25,65.35 162.25,52.09 161.28,51.11 U$2.SDA | v87.45,68.1 84.99,65.64 84.99,56.29 84.22,55.52 v78.85,55.52 | v68.9,53.64 31.77,53.64 31.76,53.65 U$3.SDA
ICDI_5V
  Bottom 1.067: U$1.5V 74.14,80.32 75.16,81.34 75.16,83.89 74.09,84.96 67.94,84.96 66.81,83.83 66.81,67.95 64.75,65.88 48.2,65.88 46.35,64.04 S1.3
L+  (via drill 0.35)
  Top 0.508: U1.2 v90.65,33.94
  Bottom 0.762: v90.65,33.94 v89.05,33.94 60.22,33.94 59.56,34.6 59.56,39.91 58.12,41.36 49.99,41.36 49.45,40.82 X1.1 L+.1
  pour Top: 91.21,34.32 88.44,34.32 88.44,33.56 91.21,33.56
L-  (via drill 0.35)
  Top 0.508: U1.4 90.83,32.64 v90.65,32.82
  Bottom 0.762: v90.65,32.82 v89.05,32.82 54.08,32.82 53.41,33.48 X1.2 L-.1
  pour Top: 91.21,33.2 88.44,33.2 88.44,32.47 91.21,32.47
N$4
  Top 0.305: R1.1 107.56,46.04 LED1.A
N$6
  Top 0.305: R3.1 64.08,61.02 PWR_LED.A
N$7
  Top 0.305: R2.1 108.14,47.44 LED2.A
N$8
  Top 0.305: R4.1 108.72,48.84 LED3.A
N$11
  Top 1.067: U$24.C 111.66,7.9 112.52,8.76 112.52,20.48 111.76,21.24 IC2.2 107.13,21.25 106.24,22.14 106.24,24.26 105.46,25.03 U$23.1
N$19
  Top 0.305: IC1.32 102.4,52.18 104.27,52.18 105.19,53.11 106.42,53.11 R5.2
NFAULT  (via drill 0.35)
  Top 0.305: U1.8 91.49,30.03 91.21,29.75 86.73,29.75 86.34,30.14 R9.1 83.3,31.45 82.91,31.84 82.91,35.77 82.47,36.22 v82.47,40.9 82.47,42.46 v83.12,43.11 | v96.16,59.13 96.46,59.13 IC1.46
  Bottom 0.305: v96.16,59.13 96.11,59.08 96.11,58.54 93.98,56.42 93.98,53.98 83.12,43.12 v83.12,43.11 | v82.47,40.9 60.78,40.9 53.11,48.57 HB-FAULT.1
OSC0
  Top 0.305: Q1.1 103.35,61.02 102.59,61.02 IC1.40 | C1.1 106.56,60.87 105.61,60.87 Q1.1 | Q1.1
OSC1
  Top 0.305: Q1.2 | Q1.2 102.24,62.13 102.24,61.37 IC1.41 | C2.1 102.09,65.34 102.09,64.39 Q1.2
PF1
  Top 0.305: IC1.29 101.9,50.56 103.04,50.56 R1.2
PF2
  Top 0.305: IC1.30 102.05,51.12 104.46,51.12 R2.2
PF3
  Top 0.305: IC1.31 102.23,51.64 104.54,51.64 105,52.11 105.45,52.11 R4.2
PF4  (via drill 0.35)
  Top 0.305: IC1.5 88.79,50.04 v87.69,50.04 | BUTTON.1 BUTTON.2 v78.17,66.06 R8.2
  Bottom 0.305: v87.69,50.04 78.73,50.04 78.17,50.6 v78.17,66.06
R+  (via drill 0.35)
  Top 0.508: U1.7 v90.65,30.69
  Bottom 0.762: v89.05,30.69 v90.65,30.69 132.03,30.69 137.08,35.74 X2.1 | X2.1 | R+.1 X2.1
  pour Top: 91.21,31.09 88.44,31.09 88.44,30.33 91.21,30.33
R-  (via drill 0.35)
  Top 0.508: U1.5 90.83,31.98 v90.65,31.81
  Bottom 0.762: v89.05,31.81 v90.65,31.81 129.84,31.81 131.29,33.25 131.29,40.11 132.77,41.59 140.08,41.59 141.07,40.59 141.07,37.67 X2.2 R-.1
  pour Top: 91.21,32.16 88.44,32.16 88.44,31.42 91.21,31.42
RST
  Top 0.305: RESET.2 122.06,66.06 114.32,66.07 RESET.1 114.31,66.06 114.3,66.06 R7.2 | IC1.38 101.81,58.82 102.46,58.82 103.58,57.7 105.09,57.7 108.32,60.93 108.32,65.66 108.71,66.06 108.72,66.06 R7.2 | U$1.RST 71.13,81.58 74.52,81.58 75.21,80.89 75.21,75.75 75.49,75.47 79.82,75.47 85.84,69.45 110.02,69.45 110.74,68.72 R7.2
RXD  (via drill 0.35)
  Top 0.305: IC1.18 97.69,47 97.69,42.73 97.16,42.2 v97.16,42.14 | v94.67,44.38 94.06,44.38 91.99,42.31 85.7,42.31 v82.5,45.51
  Bottom 0.305: v97.16,42.14 97.16,43.51 96.29,44.38 v94.67,44.38 | v82.5,45.51 77.64,50.37 77.64,65.47 77.48,65.62 77.48,66.54 77.66,66.72 77.66,74.9 77.32,75.24 U$1.RXD
SD_CS  (via drill 0.35)
  Top 0.305: IC1.45 96.81,58.77 v96.81,58.49
  Bottom 0.305: v96.81,58.49 94.5,56.18 94.5,53.7 93.98,53.18 DIS1.5
SERVO_PWM  (via drill 0.35)
  Top 0.305: IC1.61 90.74,55.35 v93.27,55.35
  Bottom 0.305: v93.27,55.35 90.74,55.35 88.81,57.28 88.81,69.09 88.47,69.44 88.47,70.87 89.19,71.59 89.19,73.44 89.01,73.61 89.01,75.56 89.79,76.33 97.46,76.33 97.79,76.66 SERVO.1 97.79,81.97 98.65,82.83 118.09,82.83 U$11.1
SSI0_MISO
  Top 0.305: IC1.21 99.34,47.47 99.34,41.56 97.79,40.01 97.79,37.34 98.45,36.68 103.86,36.68 104.14,36.96 DIS1.9
SSI0_MOSI
  Top 0.305: IC1.22 99.87,47.64 99.87,41.31 99.06,40.49 DIS1.7
SSI0_SCK  (via drill 0.35)
  Top 0.305: IC1.19 98.25,47.15 98.25,42.32 v98.07,42.14
  Bottom 0.305: v98.07,42.14 101.24,42.14 101.6,41.79 DIS1.8
TCK
  Top 0.305: IC1.52 78.95,73.51 74.8,73.51 74.32,73.03 74.32,71.96 73.86,71.51 70.16,71.51 69.85,71.81 U$1.TCK
TDI
  Top 0.305: IC1.50 81.06,72.81 79.37,74.5 74.62,74.5 74.19,74.94 74.19,76.03 73.71,76.51 68.96,76.51 68.33,77.14 68.33,79.81 68.83,80.32 U$1.TDI
TDO
  Top 0.305: IC1.49 79.6,74.99 74.93,74.99 74.7,75.22 74.7,76.28 73.71,77.27 73.71,78.67 73.33,79.05 70.23,79.05 69.85,78.67 U$1.TDO
TFT_CS
  Top 0.305: IC1.20 98.81,47.29 98.81,41.81 96.52,39.53 DIS1.6
TFT_D/C
  Top 0.305: IC1.23 98.06,50.16 97.66,50.16 95.58,48.09 95.58,47.6 96.55,46.64 96.55,43.47 93.73,40.65 91.88,40.65 91.44,40.2 DIS1.4
TFT_RESET
  Top 0.305: IC1.24 98.25,50.68 97.43,50.68 95.05,48.29 95.05,47.35 95.96,46.44 95.96,43.72 93.5,41.26 89.74,41.26 88.88,40.39 88.88,38.6 DIS1.3
TMS
  Top 0.305: IC1.51 79.16,74.01 71.08,74.01 U$1.TMS
TXD  (via drill 0.35)
  Top 0.305: IC1.17 97.13,46.85 97.13,43.21 96.25,42.33 v96.25,42.14 | v94.67,43.47 93.96,43.47 92.28,41.79 85.47,41.79 82.75,44.51 v82.5,44.51
  Bottom 0.305: v96.25,42.14 96.25,42.96 95.74,43.47 v94.67,43.47 | v82.5,44.51 81.76,45.24 81.76,45.51 77.1,50.17 77.1,65.28 76.95,65.43 76.95,66.73 77.13,66.91 77.13,72.34 76.77,72.7 U$1.TXD
UART5_RX  (via drill 0.35)
  Top 0.305: v89.79,70.16 U4.4 93.54,70.16 94.21,70.83 94.21,74.57 94.59,74.95 v100.26,74.95 v100.27,74.94 | v91.95,56.7 91.69,56.44 91.07,56.44 IC1.59
  Bottom 0.305: v91.95,56.7 91.69,56.44 91.07,56.44 89.94,57.57 89.94,70.01 v89.79,70.16 | v100.27,74.94 112.56,74.94 116.15,71.34 121.65,71.34 122.64,72.33 122.64,74.77 122.17,75.24 U$11.7
UART5_TX  (via drill 0.35)
  Top 0.305: v89.74,73.97 U4.1 92.45,74.98 92.96,75.49 99.47,75.49 99.82,75.85 v100.27,75.85 | v92.6,56.04 92.46,55.9 90.91,55.9 IC1.60
  Bottom 0.305: v89.74,73.97 89.74,71.37 89.03,70.66 89.03,69.67 89.37,69.32 89.37,57.45 90.92,55.9 92.46,55.9 v92.6,56.04 | v100.27,75.85 112.62,75.85 114.49,73.98 119.37,73.98 U$11.6
V_HB
  Top 0.61: U1.12 99.67,31.98 100.15,32.47 100.66,32.47 101.22,33.03 C20.1
  Top 0.762: C21.1 101.34,33.19 101.21,33.32
  Top 1.27: U$4.P$1 120.6,54.54 117.14,51.09 117.14,46.99 117.78,46.36 117.78,36.43 116.84,35.49 102.06,35.49 101.21,34.64 101.21,33.32 C20.1
VDDC
  Top 0.305: C9.1 101.98,47.65 IC1.25 IC1.56 89.76,59.87 88.88,59.87 C10.1
  Top 0.61: C9.1 C11.1 | C10.1 C18.1
VIN
  Top 1.905: X3.1 151.69,40.34 150.29,41.74 143.03,41.74 141.58,43.19 141.58,47.27 U$5.P$2 U$4.P$2
  Bottom 1.067: U$4.P$2 138.05,58.09 VIN.TP
VIN_REG
  Top 1.067: C15.+ 74.45,26.24 75.6,27.4 107.23,27.4 107.94,26.69 107.94,23.68 108.67,22.94 IC2.1
  Top 1.27: IC2.1 111.38,22.94 111.94,23.5 111.94,26.8 112.88,27.74 125.7,27.74 127.08,29.11 127.08,44.53 128.32,45.78 135.38,45.78 U$5.P$1
  Top 1.524: C15.+ C16.+
VINT
  Top 0.305: U1.11 99.11,31.35 100.41,30.05 104.9,30.05 105.33,30.48 C19.1
  Top 0.356: U1.11 97.38,31.35 97.1,31.63 97.1,32.96 97.42,33.28 U1.14
VX_INT1  (via drill 0.35)
  Top 0.305: IC1.7 84.94,44.78 84.94,43.85 85.94,42.84 91.72,42.84 94.17,45.29 v94.68,45.29 | v101.32,43.43 v116.18,43.43
  Bottom 0.305: v94.68,45.29 96.75,45.29 98.61,43.43 v101.32,43.43 | v116.18,43.43 160.66,43.43 161.29,44.06 161.29,47.99 160.72,48.56 158.76,48.56 U$2.INT
VX_INT2  (via drill 0.35)
  Top 0.305: IC1.6 91.36,51.91 v91.36,53.7 | v78.85,53.7 v76.42,53.7
  Bottom 0.305: v91.36,53.7 v78.85,53.7 | v76.42,53.7 70.5,53.7 68.01,56.19 U$3.INT
XSHUT1  (via drill 0.35)
  Top 0.305: IC1.9 90.82,49.24 90.15,49.24 85.48,44.58 85.48,44.07 86.19,43.36 91.43,43.36 94.27,46.2 v94.66,46.2 | v101.32,44.34 v116.18,44.34
  Bottom 0.305: v94.66,46.2 97.23,46.2 99.09,44.34 v101.32,44.34 | v116.18,44.34 158.01,44.34 158.75,45.08 U$2.XSH
XSHUT2  (via drill 0.35)
  Top 0.305: IC1.8 92.27,51.41 v92.27,53.7 | v78.85,54.61 v76.42,54.61 v76.42,54.62
  Bottom 0.305: v92.27,53.7 92.05,53.93 92.05,53.98 91.42,54.61 v78.85,54.61 | v76.42,54.62 70.85,54.62 66.74,58.73 U$3.XSH

### Text on the board
tPlace: EE445M/EE380L.6 / Real-Time OS | University of Texas at Austin / Mohammad Behnia / Zee Lv / Tariq Muhanna / Genki Oji / Abhishek Ramani / April 2019
tNames: CANL | CANH | SERVO | GND | AIN1 | SDA | AIN2 | SCL | BIN1 | UART5_RX | UART5_RX | BIN2 | UART5_TX | ICDI 5V | 5V REG | MOTOR | ON | OFF | REG | Battery